# Altium schematic sheet schematic.SchDoc
size 145 x 94 mm; Origin: Eagle
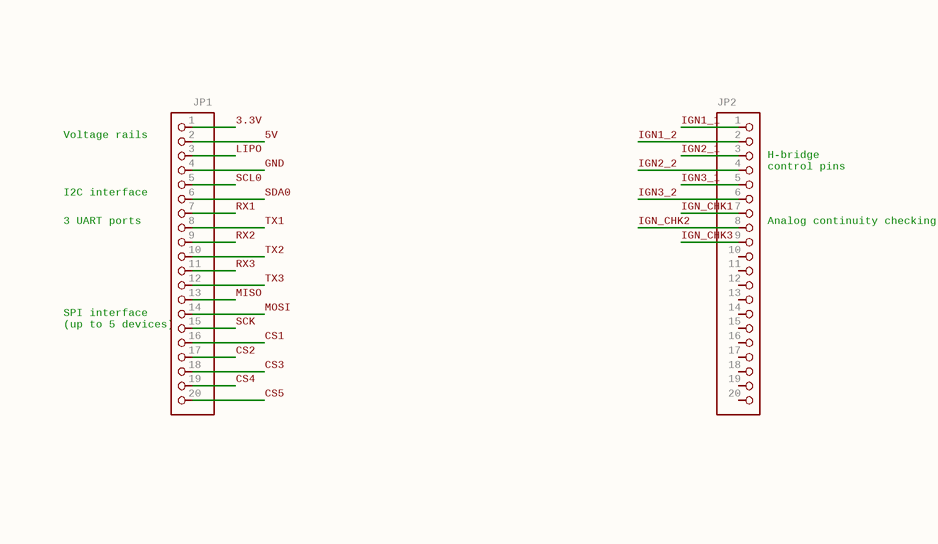
[diagram p0: schematic.SchDoc]

## Parts
JP1  PINHD-1X20  [1X20]  (value not drawn)
JP2  PINHD-1X20  [1X20]  (value not drawn)

## Nets
3.3V: JP1.1
5V: JP1.2
CS1: JP1.16
CS2: JP1.17
CS3: JP1.18
CS4: JP1.19
CS5: JP1.20
GND: JP1.4
IGN1_1: JP2.1
IGN1_2: JP2.2
IGN2_1: JP2.3
IGN2_2: JP2.4
IGN3_1: JP2.5
IGN3_2: JP2.6
IGN_CHK1: JP2.7
IGN_CHK2: JP2.8
IGN_CHK3: JP2.9
LIPO: JP1.3
MISO: JP1.13
MOSI: JP1.14
RX1: JP1.7
RX2: JP1.9
RX3: JP1.11
SCK: JP1.15
SCL0: JP1.5
SDA0: JP1.6
TX1: JP1.8
TX2: JP1.10
TX3: JP1.12

Not connected (* = marked no-connect by the designer): JP2 10 11 12 13 14 15 16 17 18 19 20

## Notes on the sheet
- (near JP1) Voltage rails
- (near JP1) I2C interface
- (near JP2) H-bridge
  control pins
- (near JP1) 3 UART ports
- (near JP2) Analog continuity checking
- (near JP1) SPI interface
  (up to 5 devices)

## Library data of the parts
JP1 JP2 = PINHD-1X20: PIN HEADER; GateName_1: A; SymbolName_1: PINHD20; LibraryName: adafruit; DeviceSetName: PINHD-1X20